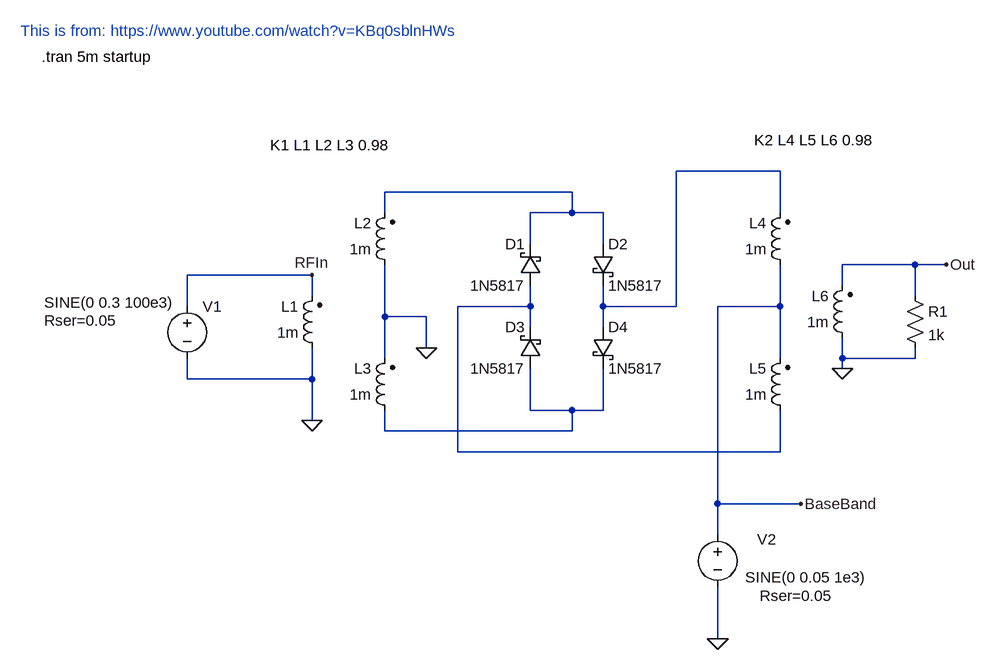
[diagram p0: schematic diode_ring_modulator_2.asc]
diode_ring_modulator_2.asc, the LTspice schematic file:
Version 4
SHEET 1 2596 716
WIRE 752 -80 592 -80
WIRE 432 -48 144 -48
WIRE 144 -16 144 -48
WIRE 432 -16 432 -48
WIRE 432 -16 368 -16
WIRE 480 -16 432 -16
WIRE 752 -16 752 -80
WIRE 368 32 368 -16
WIRE 480 32 480 -16
WIRE 960 64 848 64
WIRE 1008 64 960 64
WIRE 32 80 -160 80
WIRE 848 96 848 64
WIRE 32 112 32 80
WIRE 960 112 960 64
WIRE -160 128 -160 80
WIRE 368 128 368 96
WIRE 368 128 256 128
WIRE 480 128 480 96
WIRE 592 128 592 -80
WIRE 592 128 480 128
WIRE 752 128 752 64
WIRE 752 128 656 128
WIRE 144 144 144 64
WIRE 208 144 144 144
WIRE 368 160 368 128
WIRE 480 160 480 128
WIRE 208 192 208 144
WIRE 144 208 144 144
WIRE 752 208 752 128
WIRE 848 208 848 176
WIRE 960 208 960 192
WIRE 960 208 848 208
WIRE 848 224 848 208
WIRE -160 240 -160 208
WIRE 32 240 32 192
WIRE 32 240 -160 240
WIRE 368 288 368 224
WIRE 432 288 368 288
WIRE 480 288 480 224
WIRE 480 288 432 288
WIRE 32 304 32 240
WIRE 144 320 144 288
WIRE 432 320 432 288
WIRE 432 320 144 320
WIRE 256 352 256 128
WIRE 752 352 752 288
WIRE 752 352 256 352
WIRE 656 432 656 128
WIRE 784 432 656 432
WIRE 656 480 656 432
WIRE 656 640 656 560
FLAG 32 304 0
FLAG 848 224 0
FLAG 1008 64 Out
FLAG 208 192 0
FLAG 656 640 0
FLAG 32 80 RFIn
FLAG 784 432 BaseBand
SYMBOL ind2 48 208 R180
WINDOW 0 36 80 Left 2
WINDOW 3 36 40 Left 2
SYMATTR InstName L1
SYMATTR Value 1m
SYMATTR Type ind
SYMBOL ind2 160 80 R180
WINDOW 0 36 80 Left 2
WINDOW 3 36 40 Left 2
SYMATTR InstName L2
SYMATTR Value 1m
SYMATTR Type ind
SYMBOL ind2 160 304 R180
WINDOW 0 36 80 Left 2
WINDOW 3 36 40 Left 2
SYMATTR InstName L3
SYMATTR Value 1m
SYMATTR Type ind
SYMBOL schottky 384 96 R180
WINDOW 0 24 64 Left 2
WINDOW 3 24 0 Left 2
SYMATTR InstName D1
SYMATTR Value 1N5817
SYMATTR Description Diode
SYMATTR Type diode
SYMBOL schottky 464 32 R0
SYMATTR InstName D2
SYMATTR Value 1N5817
SYMATTR Description Diode
SYMATTR Type diode
SYMBOL schottky 384 224 R180
WINDOW 0 24 64 Left 2
WINDOW 3 24 0 Left 2
SYMATTR InstName D3
SYMATTR Value 1N5817
SYMATTR Description Diode
SYMATTR Type diode
SYMBOL schottky 464 160 R0
SYMATTR InstName D4
SYMATTR Value 1N5817
SYMATTR Description Diode
SYMATTR Type diode
SYMBOL ind2 768 80 R180
WINDOW 0 36 80 Left 2
WINDOW 3 36 40 Left 2
SYMATTR InstName L4
SYMATTR Value 1m
SYMATTR Type ind
SYMBOL ind2 768 304 R180
WINDOW 0 36 80 Left 2
WINDOW 3 36 40 Left 2
SYMATTR InstName L5
SYMATTR Value 1m
SYMATTR Type ind
SYMBOL ind2 864 192 R180
WINDOW 0 36 80 Left 2
WINDOW 3 36 40 Left 2
SYMATTR InstName L6
SYMATTR Value 1m
SYMATTR Type ind
SYMBOL voltage -160 112 R0
WINDOW 3 -220 10 Left 2
WINDOW 123 0 0 Left 0
WINDOW 39 -220 38 Left 2
SYMATTR InstName V1
SYMATTR Value SINE(0 0.3 100e3)
SYMATTR SpiceLine Rser=0.05
SYMBOL voltage 656 464 R0
WINDOW 0 76 38 Bottom 2
WINDOW 3 136 66 Top 2
WINDOW 123 0 0 Left 0
WINDOW 39 121 94 Top 2
SYMATTR InstName V2
SYMATTR Value SINE(0 0.05 1e3)
SYMATTR SpiceLine Rser=0.05
SYMBOL res 944 96 R0
SYMATTR InstName R1
SYMATTR Value 1k
TEXT 712 -128 Left 2 !K2 L4 L5 L6 0.98
TEXT -32 -120 Left 2 !K1 L1 L2 L3 0.98
TEXT -384 -256 Left 2 !.tran 5m startup
TEXT -416 -296 Left 2 ;This is from: https://www.youtube.com/watch?v=KBq0sblnHWs

The netlist it stands for:
* diode_ring_modulator_2.asc
L1 0 RFIn 1m
L2 0 N002 1m
L3 N004 0 1m
D1 N003 N002 1N5817
D2 N002 N001 1N5817
D3 N004 N003 1N5817
D4 N001 N004 1N5817
L4 BaseBand N001 1m
L5 N003 BaseBand 1m
L6 0 Out 1m
V1 RFIn 0 SINE(0 0.3 100e3) Rser=0.05
V2 BaseBand 0 SINE(0 0.05 1e3) Rser=0.05
R1 Out 0 1k
.model D D
.lib standard.dio
K2 L4 L5 L6 0.98
K1 L1 L2 L3 0.98
.tran 5m startup
* This is from: https://www.youtube.com/watch?v=KBq0sblnHWs
.backanno
.end